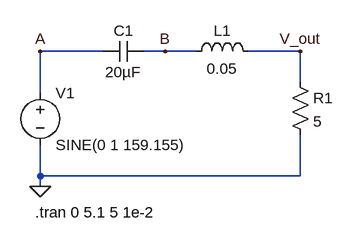
[diagram p0: schematic assig3_q1.asc]
assig3_q1.asc, the LTspice schematic file:
Version 4
SHEET 1 880 680
WIRE 256 16 160 16
WIRE 352 16 320 16
WIRE 400 16 352 16
WIRE 560 16 480 16
WIRE 560 64 560 16
WIRE 160 80 160 16
WIRE 160 208 160 160
WIRE 560 208 560 144
WIRE 560 208 160 208
WIRE 160 224 160 208
FLAG 160 224 0
FLAG 560 16 V_out
FLAG 160 16 A
FLAG 352 16 B
SYMBOL voltage 160 64 R0
WINDOW 123 0 0 Left 0
WINDOW 39 0 0 Left 0
SYMATTR InstName V1
SYMATTR Value SINE(0 1 159.155)
SYMBOL ind 384 32 R270
WINDOW 0 32 56 VTop 2
WINDOW 3 5 56 VBottom 2
SYMATTR InstName L1
SYMATTR Value 0.05
SYMBOL cap 320 0 R90
WINDOW 0 0 32 VBottom 2
WINDOW 3 32 32 VTop 2
SYMATTR InstName C1
SYMATTR Value 20µF
SYMBOL res 544 48 R0
SYMATTR InstName R1
SYMATTR Value 5
TEXT 152 264 Left 2 !.tran 0 5.1 5 1e-2

The netlist it stands for:
* assig3_q1.asc
V1 A 0 SINE(0 1 159.155)
L1 B V_out 0.05
C1 B A 20µF
R1 V_out 0 5
.tran 0 5.1 5 1e-2
.backanno
.end